# Altium schematic sheet S4_MotorDriver.SchDoc
size A4
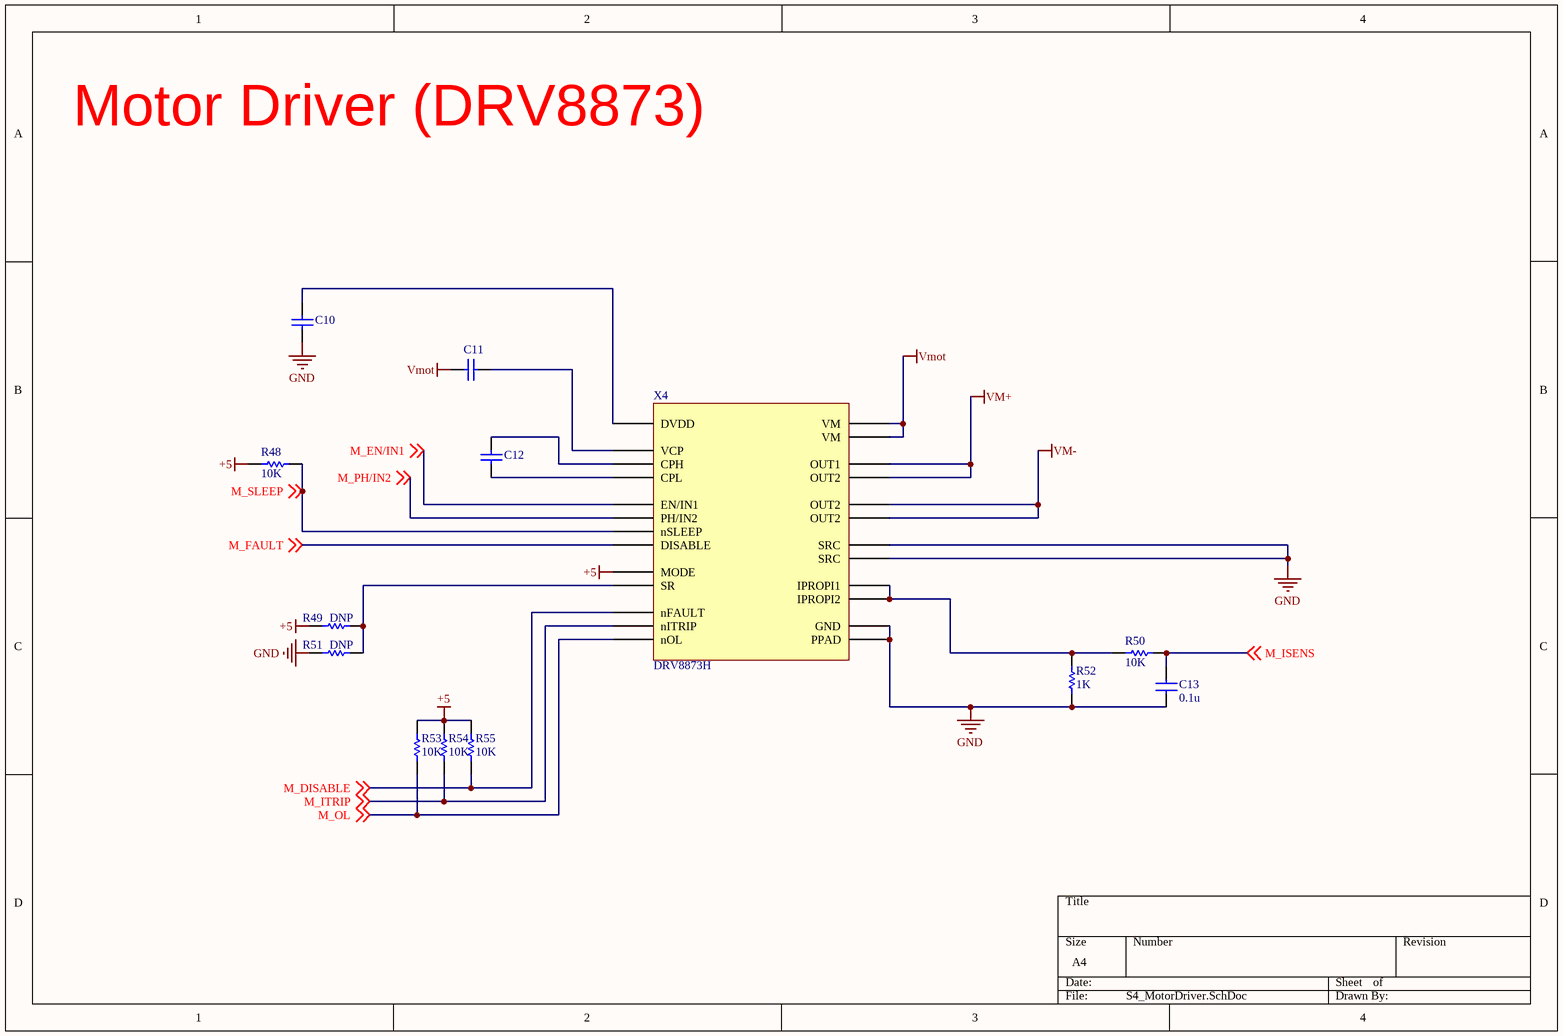
[diagram p0: S4_MotorDriver.SchDoc]

## Parts
C10  CAP 1uF 6.3V 1206(3216)  [CAPC1206(3216)130_M]  (value not drawn)
C11  CAP 1uF 25V 1206(3216)  [CAPC1206(3216)130_M]  (value not drawn)
C12  CAP 47nF 50V 1206(3216)  [CAPC1206(3216)130_L]  (value not drawn)
C13  0.1u  [Ceramic Cap 5mm]
R48  value 10K  [AXIAL-0.3-3D]  (hidden comment: Res1)
R49  value DNP  [AXIAL-0.3-3D]  (hidden comment: Res1)
R50  value 10K  [AXIAL-0.3-3D]  (hidden comment: Res1)
R51  value DNP  [AXIAL-0.3-3D]  (hidden comment: Res1)
R52  value 1K  [AXIAL-0.3-3D]  (hidden comment: Res1)
R53  value 10K  [AXIAL-0.3-3D]  (hidden comment: Res1)
R54  value 10K  [AXIAL-0.3-3D]  (hidden comment: Res1)
R55  value 10K  [AXIAL-0.3-3D]  (hidden comment: Res1)
X4  DRV8873H  [DRV8873]

## Nets
+5: R48.1 R49.2 R53.2 R54.2 R55.2 X4.3(MODE)
GND: C10.1 C13.2 R51.2 R52.2 X4.16(SRC) X4.17(SRC) X4.24(GND) X4.25(PPAD)
VM+: X4.18(OUT2) X4.19(OUT1)
VM-: X4.14(OUT2) X4.15(OUT2)
Vmot: C11.1 X4.13(VM) X4.20(VM)
M_DISABLE: R55.1 X4.2(nFAULT) ; off-sheet M_DISABLE
M_EN/IN1: X4.7(EN/IN1) ; off-sheet M_EN/IN1
M_FAULT: X4.9(DISABLE) ; off-sheet M_FAULT
M_ISENS: C13.1 R50.1 ; off-sheet M_ISENS
M_ITRIP: R54.1 X4.5(nITRIP) ; off-sheet M_ITRIP
M_OL: R53.1 X4.6(nOL) ; off-sheet M_OL
M_PH/IN2: X4.8(PH/IN2) ; off-sheet M_PH/IN2
M_SLEEP: R48.2 X4.11(nSLEEP) ; off-sheet M_SLEEP
NetC10_2: C10.2 X4.1(DVDD)
NetC11_2: C11.2 X4.21(VCP)
NetC12_1: C12.1 X4.23(CPL)
NetC12_2: C12.2 X4.22(CPH)
NetR49_1: R49.1 R51.1 X4.4(SR)
NetR50_2: R50.2 R52.1 X4.10(IPROPI1) X4.12(IPROPI2)

## Notes on the sheet
- Motor Driver (DRV8873)

## Library data of the parts
C10 = CMP-1037-04669-1: CAP 1uF 6.3V ±20% 1206 (3216 Metric) Thickness 1.2mm SMD; Tolerance: Â±20%; Case-Metric: 3216; Case-EIA: 1206; Max Thickness: 1.2 mm; Technology: SMT; Rated Voltage: 6.3 V; Value: 1uF
C11 = CMP-1037-04700-1: CAP 1uF 25V ±10% 1206 (3216 Metric) Thickness 1.3mm SMD; Tolerance: Â±10%; Case-Metric: 3216; Case-EIA: 1206; Value: 1uF; Rated Voltage: 25 V; Max Thickness: 1.3 mm; Technology: SMT
C12 = CMP-1037-03986-1: CAP 47nF 50V ±20% 1206 (3216 Metric) Thickness 1.2mm SMD; Case-EIA: 1206; Case-Metric: 3216; Tolerance: Â±20%; Technology: SMT; Max Thickness: 1.2 mm; Rated Voltage: 50 V; Value: 47nF
C13 = Cap
R48-R55 = Res1: Resistor; Published: 8-Jun-2000; LatestRevisionDate: 17-Jul-2002; LatestRevisionNote: Re-released for DXP Platform.; PackageReference: AXIAL-0.3; Publisher: Altium Limited; PackageDescription: Axial Device, Thru-Hole; 2 Leads; 0.3 in Pin Spacing
X4 = DRV8873: DRV8873-Q1 Automotive H-Bridge Motor Driver / This one is the H version, with Hbridge gate controls (no SPI)